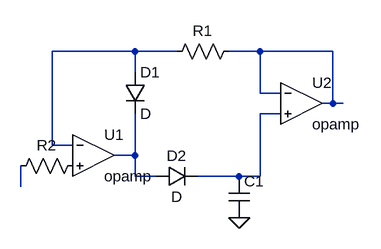
[diagram p0: schematic peak detector.asc]
peak detector.asc, the LTspice schematic file:
Version 4
SHEET 1 880 680
WIRE 160 208 32 208
WIRE 224 208 160 208
WIRE 352 208 304 208
WIRE 464 208 352 208
WIRE 160 240 160 208
WIRE 352 272 352 208
WIRE 384 272 352 272
WIRE 464 288 464 208
WIRE 464 288 448 288
WIRE 480 288 464 288
WIRE 384 304 352 304
WIRE 32 352 32 208
WIRE 64 352 32 352
WIRE 160 368 160 304
WIRE 160 368 128 368
WIRE 160 400 160 368
WIRE 192 400 160 400
WIRE 320 400 256 400
WIRE 352 400 352 304
WIRE 352 400 320 400
WIRE -16 416 -16 384
FLAG 320 464 0
SYMBOL Opamps/opamp 96 304 R0
SYMATTR InstName U1
SYMBOL Opamps/opamp 416 224 R0
SYMATTR InstName U2
SYMBOL cap 304 400 R0
SYMATTR InstName C1
SYMATTR Value ""
SYMBOL diode 144 240 R0
SYMATTR InstName D1
SYMBOL diode 192 416 R270
WINDOW 0 32 32 VTop 2
WINDOW 3 0 32 VBottom 2
SYMATTR InstName D2
SYMBOL res 320 192 R90
WINDOW 0 0 56 VBottom 2
WINDOW 3 32 56 VTop 2
SYMATTR InstName R1
SYMATTR Value ""
SYMBOL res 80 368 R90
WINDOW 0 0 56 VBottom 2
WINDOW 3 32 56 VTop 2
SYMATTR InstName R2
SYMATTR Value ""

The netlist it stands for:
* peak detector.asc
XU1 N001 P001 N004 opamp Aol=100K GBW=10Meg  ; pins invin noninvin out
XU2 N002 N003 N002 opamp Aol=100K GBW=10Meg  ; pins invin noninvin out
C1 N003 0
D1 N001 N004 D
D2 N004 N003 D
R1 N002 N001
R2 P001 N005
.model D D
.lib standard.dio
.backanno
.end